# EAGLE design TouScruino-v1 (EAGLE 6.3)
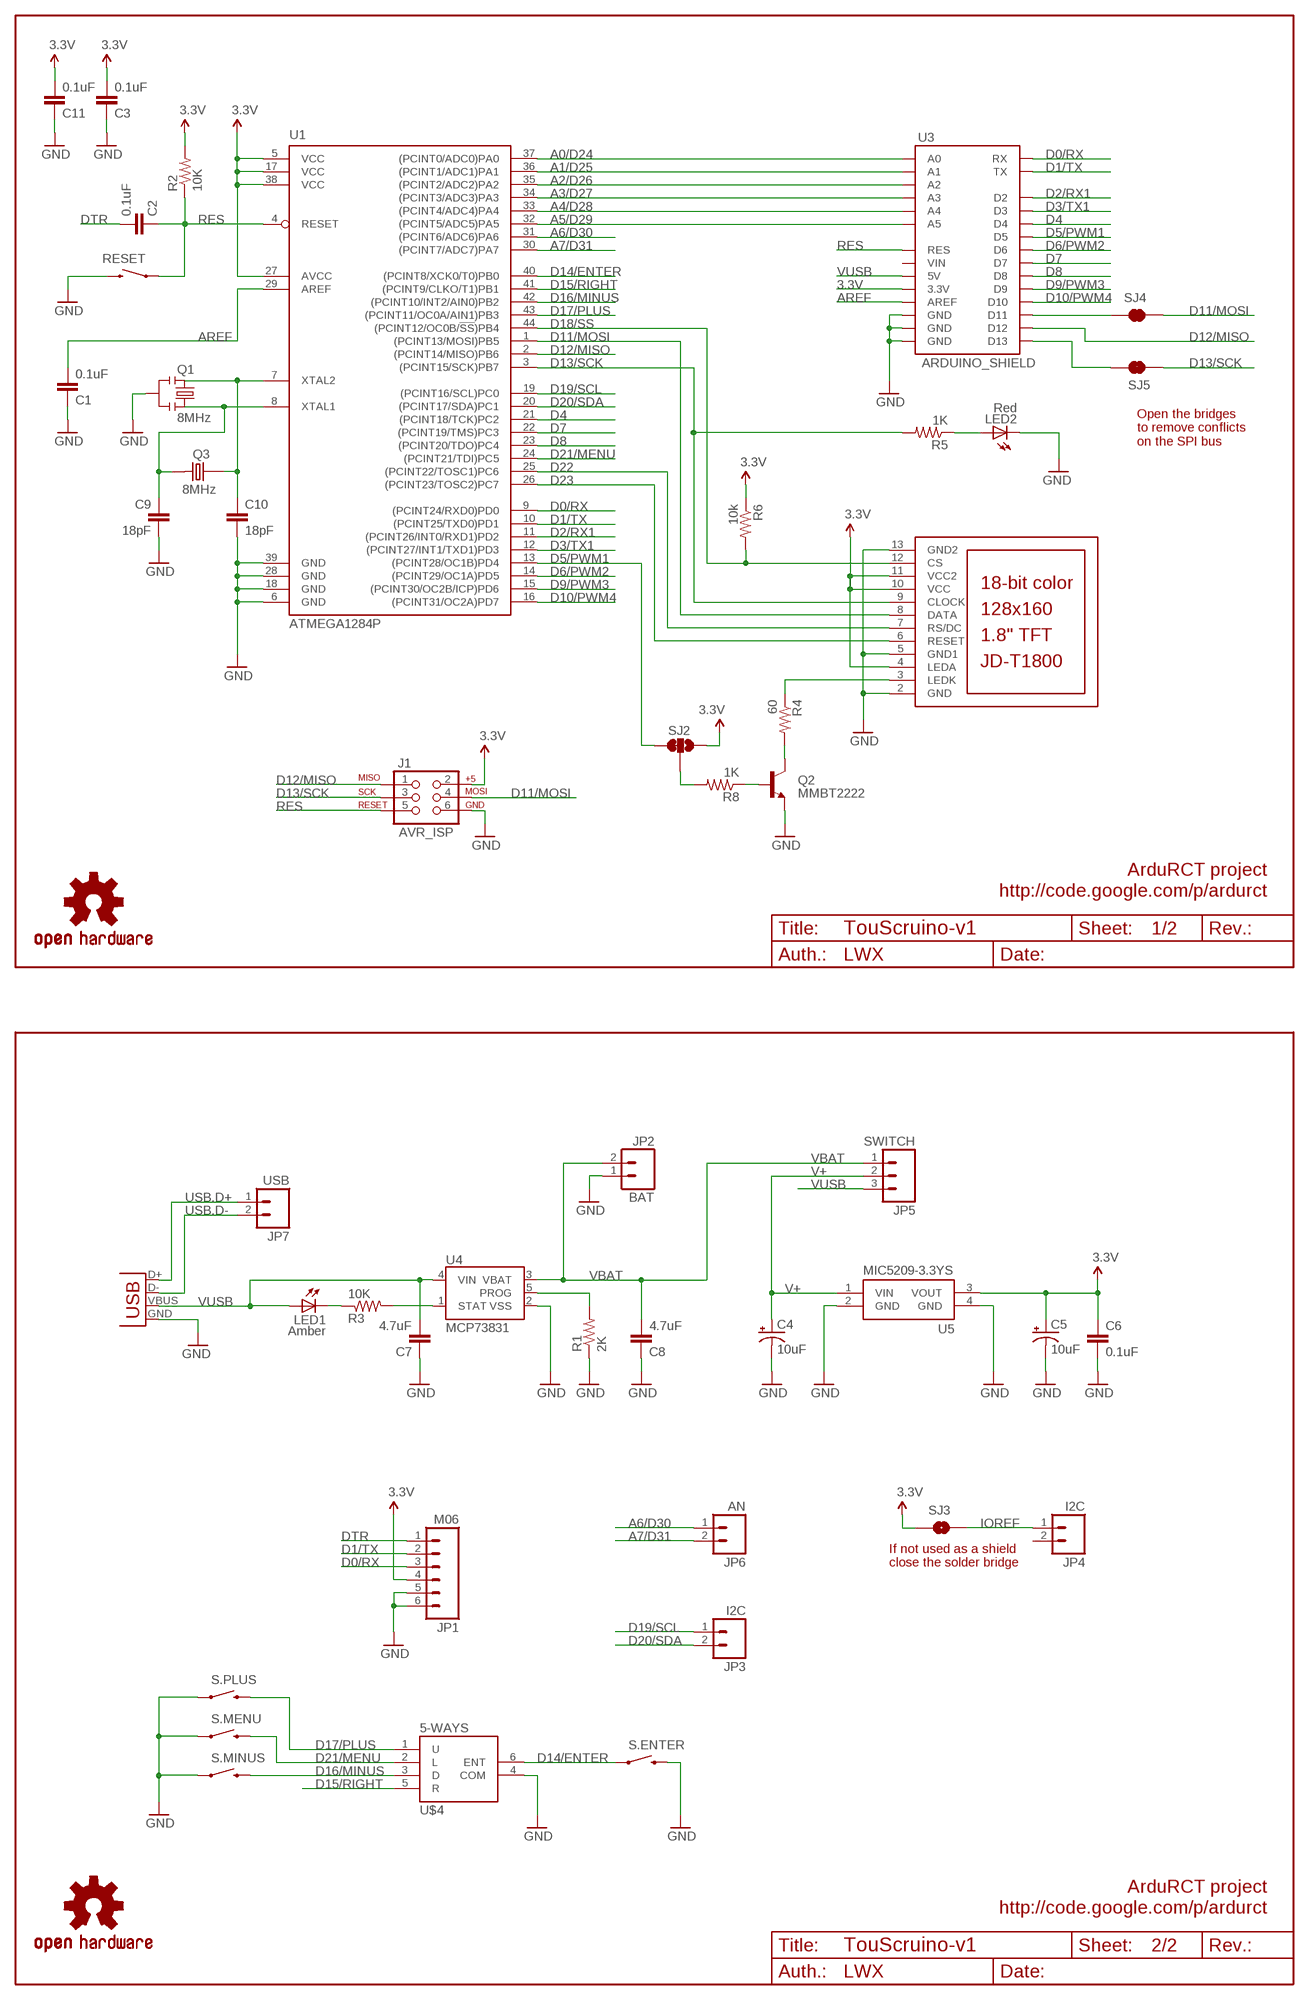
[diagram p0: schematic, sheet 1]

## Parts
C1  0.1uF  CAP0805  [0805]
C2  0.1uF  CAP0805  [0805]
C3  0.1uF  CAP0805  [0805]
C4  10uF  CAP_POL1206  [EIA3216]
C5  10uF  CAP_POL1206  [EIA3216]
C6  0.1uF  CAP0805  [0805]
C7  4.7uF  CAP0805  [0805]
C8  4.7uF  CAP0805  [0805]
C9  18pF  CAP0603-CAP  [0603-CAP]
C10  18pF  CAP0603-CAP  [0603-CAP]
C11  0.1uF  CAP0805  [0805]
J1  AVR_ISP  AVR_SPI_PRG_6PTH  [2X3]
JP1  M06  [1X06]
JP2  BAT  M02-JST-2MM-SMT  [JST-2-SMD]
JP3  I2C  M02  [1X02]
JP4  I2C  M02  [1X02]
JP5  SWITCH  M03  [1X3_LONGPAD]
JP6  AN  M02  [1X02]
JP7  USB  M02  [1X02]
LCD1  JD-T1800  [JD-T1800]
LED1  Amber  LED  [LED]
LED2  Red  LED805  [LED-0805]
Q1  8MHz  RESONATORSMD  [RESONATOR-SMD]
Q2  MMBT2222  TRANSISTOR_NPNSOT23-3  [SOT23-3]
Q3  8MHz  CRYSTAL_5X3.2  [CRYSTAL_5X3.2]
R1  2K  RESISTOR0805-RES  [0805]
R2  10K  RESISTOR0805-RES  [0805]
R3  10K  RESISTOR0805-RES  [0805]
R4  60  RESISTOR0805-RES  [0805]
R5  1K  RESISTOR0805-RES  [0805]
R6  10k  RESISTOR0805-RES  [0805]
R8  1K  RESISTOR0805-RES  [0805]
RESET  SWITCH-MOMENTARY-2SMD  [TACTILE_SWITCH_SMD]
S.ENTER  SWITCH_SMD  [TACTILE_SWITCH_SMD]
S.MENU  SWITCH_SMD  [TACTILE_SWITCH_SMD]
S.MINUS  SWITCH_SMD  [TACTILE_SWITCH_SMD]
S.PLUS  SWITCH_SMD  [TACTILE_SWITCH_SMD]
SJ2  SJ_2WAYS_1-2  [SJ_2WAYS_1-2_S]
SJ3  SOLDERJUMPERNO  [SJ_2S-NO]
SJ4  SOLDERJUMPERTRACE  [SJ_2S-TRACE]
SJ5  SOLDERJUMPERTRACE  [SJ_2S-TRACE]
U1  ATMEGA1284P  ATMEGA324A  [TQFP44]
U3  ARDUINO_SHIELD  [ARDUINO_SHIELD]
U4  MCP73831  [SOT23-5]
U5  MIC5209-3.3YS  MIC5209  [SOT223]
U$3  OSHW-LOGOM  [OSHW-LOGO-M]
U$4  5-WAYS  [5-WAYS_ALPS]
U$5  OSHW-LOGOM  [OSHW-LOGO-M]
X1  USBSMD  [USB-MINIB]

## Nets
3.3V: C3.2 C5.A(+) C6.1 C11.2 J1.2 JP1.4 LCD1.4(LEDA) LCD1.10(VCC) LCD1.11(VCC2) R2.2 R6.1 SJ2.3 SJ3.1 U1.5(VCC) U1.17(VCC) U1.27(AVCC) U1.38(VCC) U3.3.3V U5.3(VOUT)
A0/D24: U1.37((PCINT0/ADC0)PA0) U3.A0
A1/D25: U1.36((PCINT1/ADC1)PA1) U3.A1
A2/D26: U1.35((PCINT2/ADC2)PA2) U3.A2
A3/D27: U1.34((PCINT3/ADC3)PA3) U3.A3
A4/D28: U1.33((PCINT4/ADC4)PA4) U3.A4
A5/D29: U1.32((PCINT5/ADC5)PA5) U3.A5
A6/D30: JP6.1 U1.31((PCINT6/ADC6)PA6)
A7/D31: JP6.2 U1.30((PCINT7/ADC7)PA7)
AREF: C1.2 U1.29(AREF) U3.AREF
BL_CMD: R8.2 SJ2.2
D0/RX: JP1.3 U1.9((PCINT24/RXD0)PD0) U3.RX
D1/TX: JP1.2 U1.10((PCINT25/TXD0)PD1) U3.TX
D2/RX1: U1.11((PCINT26/INT0/RXD1)PD2) U3.D2
D3/TX1: U1.12((PCINT27/INT1/TXD1)PD3) U3.D3
D4: U1.21((PCINT18/TCK)PC2) U3.D4
D5/PWM1: SJ2.1 U1.13((PCINT28/OC1B)PD4) U3.D5
D6/PWM2: U1.14((PCINT29/OC1A)PD5) U3.D6
D7: U1.22((PCINT19/TMS)PC3) U3.D7
D8: U1.23((PCINT20/TDO)PC4) U3.D8
D9/PWM3: U1.15((PCINT30/OC2B/ICP)PD6) U3.D9
D10/PWM4: U1.16((PCINT31/OC2A)PD7) U3.D10
D11/MOSI: J1.4 LCD1.8(DATA) SJ4.2 U1.1((PCINT13/MOSI)PB5)
D12/MISO: J1.1 U1.2((PCINT14/MISO)PB6) U3.D12
D13/SCK: J1.3 LCD1.9(CLOCK) R5.2 SJ5.1 U1.3((PCINT15/SCK)PB7)
D14/ENTER: S.ENTER.1 U1.40((PCINT8/XCK0/T0)PB0) U$4.6(ENT)
D15/RIGHT: U1.41((PCINT9/CLKO/T1)PB1) U$4.5(R)
D16/MINUS: S.MINUS.3 U1.42((PCINT10/INT2/AIN0)PB2) U$4.3(D)
D17/PLUS: S.PLUS.3 U1.43((PCINT11/OC0A/AIN1)PB3) U$4.1(U)
D18/SS: LCD1.12(CS) R6.2 U1.44((PCINT12/OC0B/!SS!)PB4)
D19/SCL: JP3.1 U1.19((PCINT16/SCL)PC0)
D20/SDA: JP3.2 U1.20((PCINT17/SDA)PC1)
D21/MENU: S.MENU.3 U1.24((PCINT21/TDI)PC5) U$4.2(L)
D22: LCD1.7(RS/DC) U1.25((PCINT22/TOSC1)PC6)
D23: LCD1.6(RESET) U1.26((PCINT23/TOSC2)PC7)
DTR: C2.2 JP1.1
GND [vcc]: C1.1 C3.1 C4.C(-) C5.C(-) C6.2 C7.1 C8.1 C9.2 C10.2 C11.1 J1.6 JP1.5 JP1.6 JP2.1 LCD1.2(GND) LCD1.5(GND1) LCD1.13(GND2) LED2.2(C) Q1.2 Q2.2(E) R1.1 RESET.3 S.ENTER.3 S.MENU.1 S.MINUS.1 S.PLUS.1 U1.6(GND) U1.18(GND) U1.28(GND) U1.39(GND) U3.GND@0(GND) U3.GND@1(GND) U3.GND@2(GND) U4.2(VSS) U5.2(GND) U5.4(GND) U$4.4(COM) X1.GND
IOREF: JP4.1 SJ3.2
N$1: C9.1 Q1.1 Q3.2 U1.8(XTAL1)
N$2: C10.1 Q1.3 Q3.1 U1.7(XTAL2)
N$3: LCD1.3(LEDK) R4.1
N$4: Q2.1(B) R8.1
N$5: LED2.1(A) R5.1
N$6: SJ4.1 U3.D11
N$8: LED1.C1(C) R3.1
N$9: SJ5.2 U3.D13
N$12: R3.2 U4.1(STAT)
N$13: R1.2 U4.5(PROG)
N$17: Q2.3(C) R4.2
RES: C2.1 J1.5 R2.1 RESET.1 U1.4(RESET) U3.RES
USB.D+: JP7.1 X1.D+
USB.D-: JP7.2 X1.D-
V+: C4.A(+) JP5.2 U5.1(VIN)
VBAT: C8.2 JP2.2 JP5.1 U4.3(VBAT)
VUSB: C7.2 JP5.3 LED1.A1(A) U3.5V U4.4(VIN) X1.VBUS
Unconnected: JP4.2 U3.VIN

## Notes on the sheet
- Open the bridges
  to remove conflicts
  on the SPI bus
- ArduRCT project
- http://code.google.com/p/ardurct
- 1/2
- LWX
- If not used as a shield
  close the solder bridge
- ArduRCT project
- http://code.google.com/p/ardurct
- 2/2
- LWX

## Library data of the parts
C1-C3 C6-C11 = SparkFun:CAP: Capacitor Standard 0603 ceramic capacitor, and 0.1" leaded capacitor.
C4 C5 = SparkFun:CAP_POL: Capacitor Polarized These are standard SMD and PTH capacitors. Normally 10uF, 47uF, and 100uF in electrolytic and tantalum varieties. Always verify the external diameter of the through hole cap, it varies with capacity, voltage, and manufacturer. The EIA devices should be standard.
J1 = SparkFun:AVR_SPI_PRG_6: AVR ISP 6 Pin This is the reduced ISP connector for AVR programming. Common on Arduino. This footprint will take up less PCB space and can be used with a 10-pin to 6-pin adapter such as SKU: BOB-08508
JP1 = wibauxl:M06
JP2 = SparkFun:M02: Header 2 Standard 2-pin 0.1" header. Use with straight break away headers (SKU : PRT-00116), right angle break away headers (PRT-00553), swiss pins (PRT-00743), machine pins (PRT-00117), and female headers (PRT-00115). Molex polarized connector foot print use with SKU : PRT-08233 with associated crimp pins and housings.
JP3 JP4 JP6 JP7 = wibauxl:M02
JP5 = wibauxl:M03
LCD1 = adafruit:JD-T1800
LED1 LED2 = wibauxl:LED
Q1 = SparkFun:RESONATOR: Resonator Small SMD resonator. This is the itty bitty 10/20MHz resonators with built in caps. CSTCE10M0G55 and CSTCE20M0V53. Footprint has been reviewed closely but hasn't been tested yet.
Q2 = SparkFun:TRANSISTOR_NPN: Transistor NPN BJT configuration in SOT23 package. MMBT2222 is the common NPN we use. Double check BCE configuration again layout.
Q3 = wibauxl:CRYSTAL_5X3.2
R1-R6 R8 = SparkFun:RESISTOR: Resistor Basic schematic elements and footprints for 0603, 1206, and PTH resistors.
RESET = SparkFun:SWITCH-MOMENTARY-2
S.ENTER S.MENU S.MINUS S.PLUS = wibauxl:SWITCH_SMD
SJ2 = wibauxl:SJ_2WAYS_1-2
SJ3-SJ5 = SparkFun:SOLDERJUMPER: Solder Jumper Standard SMD solder jumper. Used to automate production. Two varients : Normally Open and Normally Closed are the same, but have different paste layers. NC will have a large amount of paste and should jumper during reflow.
U1 = wibauxl:ATMEGA324: 8-bit Microcontroller with 64K Bytes In-System Programmable Flash Source: http://www.atmel.com/dyn/resources/prod_documents/doc2593.pdf
U3 = wibauxl:ARDUINO_SHIELD
U4 = SparkFun:MCP73831: Microchip's MCP73831 Miniature single cell, fully integrated Li-Ion, Li-polymer charge management controller http://ww1.microchip.com/downloads/en/DeviceDoc/21984a.pdf
U5 = wibauxl:MIC5209
U$3 U$5 = SparkFun:OSHW-LOGO: Open Source Hardware Logo This logo indicates the piece of hardware it is found on incorporates a OSHW license and/or adheres to the definition of open source hardware found here: http://freedomdefined.org/OSHW
U$4 = wibauxl:5-WAYS
X1 = SparkFun:USB: USB Connectors USB-B-PTH is fully proven SKU : PRT-00139 USB-miniB is fully proven SKU : PRT-00587 USB-A-PCB is untested. USB-A-H is throughly reviewed, but untested. Spark Fun Electronics SKU : PRT-00437 USB-B-SMT is throughly reviewed, but untested. Needs silkscreen touching up. USB-A-S has not been used/tested USB-MB-H has not been used/tested

## Net classes
0 default: width 0.203 mm
1 vcc: width 0.254 mm

## Board
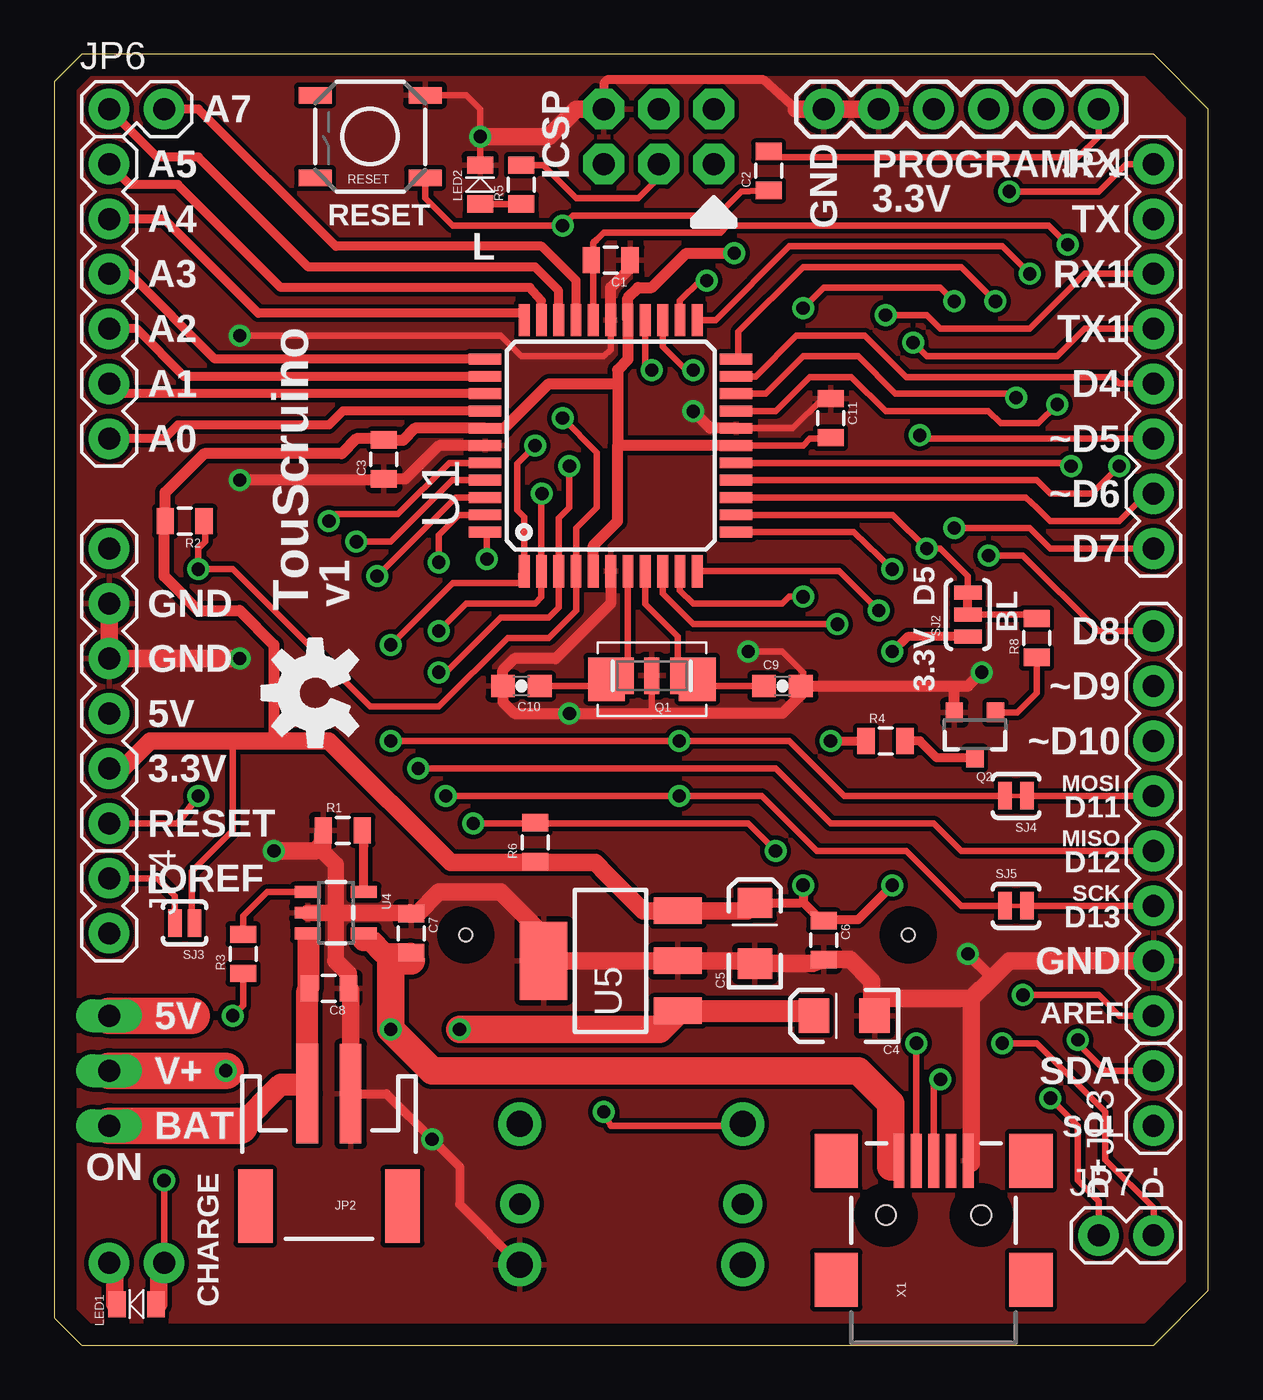
[diagram p1: board, top side]
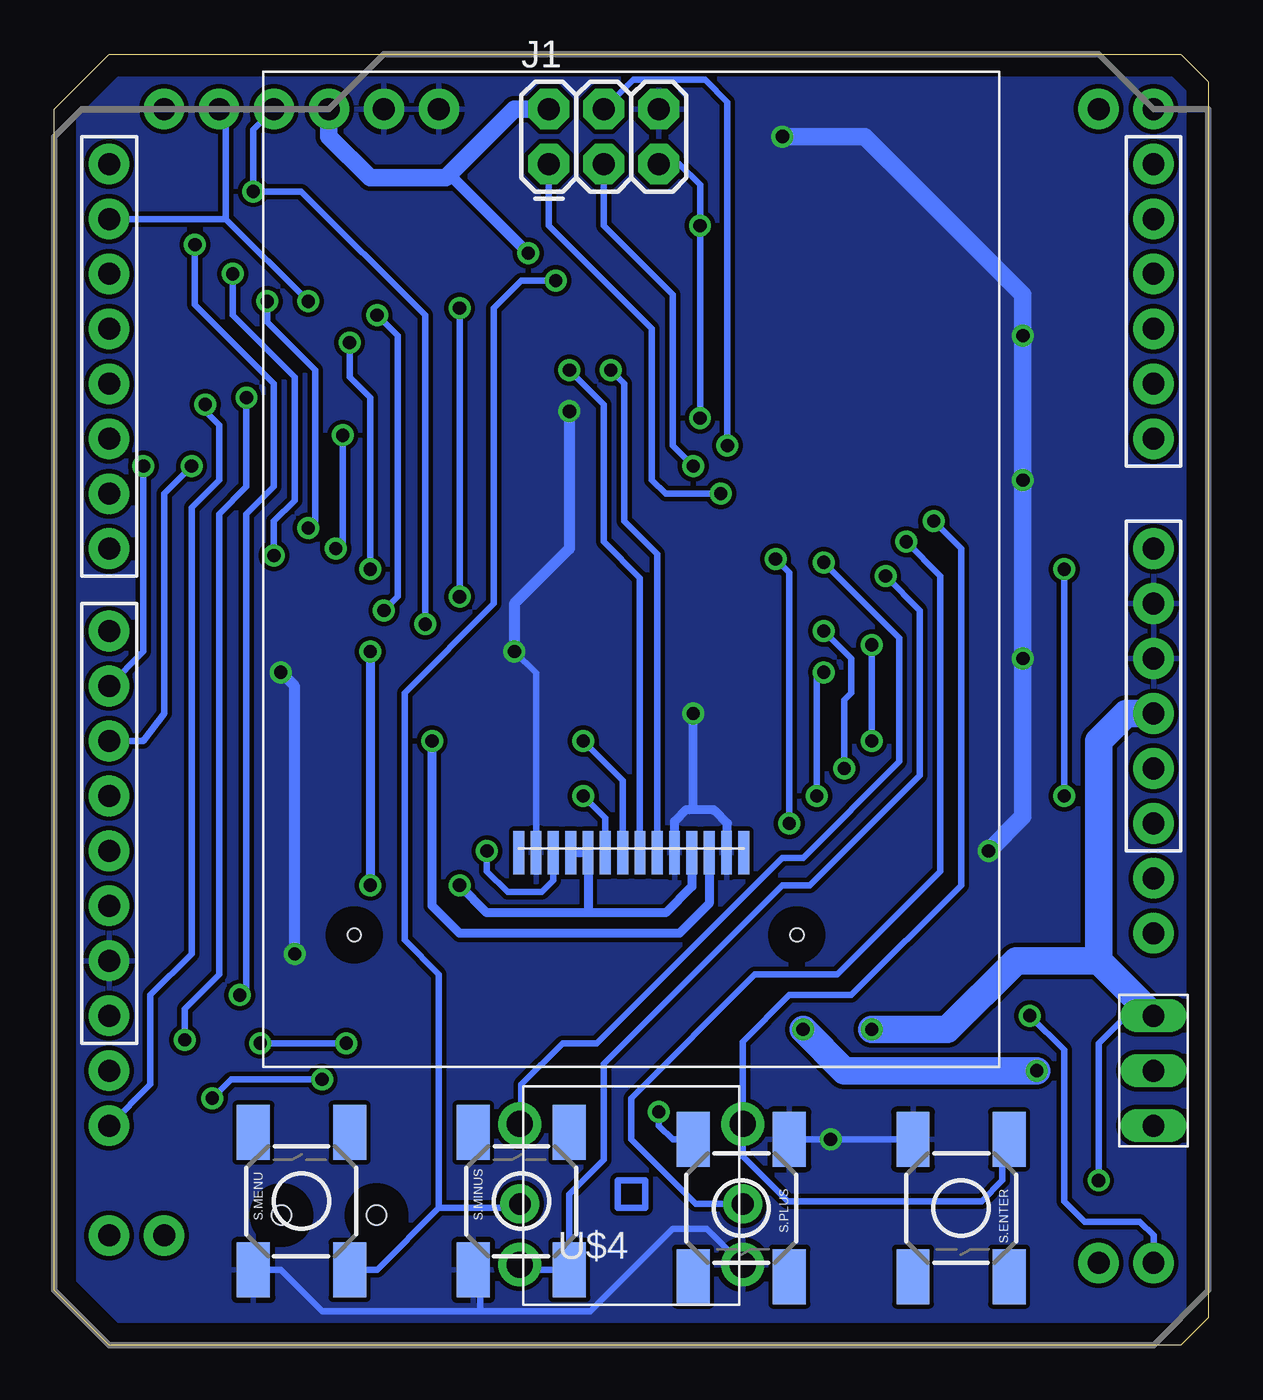
[diagram p2: board, bottom side, seen from below]

Size 53.34 x 59.69 mm. Coordinates in mm from the lower left corner, seen from the top.
Outline: 53.34,2.54 53.34,57.15 50.8,59.69 1.27,59.69 0,58.42 0,1.27 1.27,0 50.8,0 53.34,2.54
Copper layers (1*16): Top 0.035mm / dielectric 1.5mm / Bottom 0.035mm
Design rules "default": minimum track width 10mil, minimum drill 24mil, track to track 8mil, track to pad 8mil, pad to pad 8mil, via to via 8mil, smd to smd 8mil, copper to edge 40mil, drill to drill 8mil, minimum pad ring 10mil, minimum via ring 8mil, stop-mask expansion 4mil, vias tented up to drill 0mil, thermal gap 10mil

### Footprints (pad centres in the part's own frame; a part is rotated, then mirrored left to right if it is on the bottom)
0805 = smd 0.8 x 1.2: 1 -0.9,0; 2 0.9,0
EIA3216 = smd 1.4 x 1.6: A 1.4,0; C -1.4,0
0603-CAP = smd 1.1 x 1: 1 -0.85,0; 2 0.85,0
2X3 = drill 1.016 pad 1.88 octagon: 1 0,0; 2 0,2.54; 3 2.54,0; 4 2.54,2.54; 5 5.08,0; 6 5.08,2.54
1X06 = drill 1.016 pad 1.88: 1 0,0; 2 2.54,0; 3 5.08,0; 4 7.62,0; 5 10.16,0; 6 12.7,0
JST-2-SMD = smd 1 x 4.6: 1 -1,-3.7; 2 1,-3.7 | smd 1.6 x 3.4: NC1 -3.4,1.5; NC2 3.4,1.5
1X02 = drill 1.016 pad 1.88: 1 0,0; 2 2.54,0
1X3_LONGPAD = drill 1.016 pad 1.245 long: 1 0,0; 2 -2.54,0; 3 -5.08,0
JD-T1800 = smd 0.5 x 2: 1 5.2,-13.1; 2 4.4,-13.1; 3 3.6,-13.1; 4 2.8,-13.1; 5 2,-13.1; 6 1.2,-13.1; 7 0.4,-13.1; 8 -0.4,-13.1; 9 -1.2,-13.1; 10 -2,-13.1; 11 -2.8,-13.1; 12 -3.6,-13.1; 13 -4.4,-13.1; 14 -5.2,-13.1 | hole 0.61: -12.8,-16.9; 7.65,-16.9
LED = smd 0.8 x 1.2: A -0.9,0; C 0.9,0 | drill 1.016 pad 1.88: A1 -1.27,-1.905; C1 1.27,-1.905
LED-0805 = smd 0.8 x 1.2: 1 -0.9,0; 2 0.9,0
RESONATOR-SMD = smd 0.7 x 1.7: 1 -1.2,0; 2 0,0; 3 1.2,0
SOT23-3 = smd 0.8 x 0.9: 1 -0.95,-1; 2 0.95,-1; 3 0,1.1
CRYSTAL_5X3.2 = smd 1.7 x 2: 1 2.1,0; 2 -2.1,0
TACTILE_SWITCH_SMD = smd 1.524 x 0.762: 1 -2.54,1.905; 2 2.54,1.905; 3 -2.54,-1.905; 4 2.54,-1.905
TACTILE_SWITCH_SMD' = smd 2.54 x 1.524: 1 -3.175,2.223; 2 3.175,2.223; 3 -3.175,-2.223; 4 3.175,-2.223
SJ_2WAYS_1-2_S = smd 0.635 x 1.27: 1 0.508,0; 2 -0.508,0; 3 -1.524,0
SJ_2S-NO = smd 0.635 x 1.27: 1 -0.45,0; 2 0.45,0
SJ_2S-TRACE = smd 0.635 x 1.27: 1 -0.508,0; 2 0.508,0
TQFP44 = smd 1.5 x 0.5: 1 -5.8,4; 2 -5.8,3.2; 3 -5.8,2.4; 4 -5.8,1.6; 5 -5.8,0.8; 6 -5.8,0; 7 -5.8,-0.8; 8 -5.8,-1.6; 9 -5.8,-2.4; 10 -5.8,-3.2; 11 -5.8,-4; 23 5.8,-4; 24 5.8,-3.2; 25 5.8,-2.4; 26 5.8,-1.6; 27 5.8,-0.8; 28 5.8,0; 29 5.8,0.8; 30 5.8,1.6; 31 5.8,2.4; 32 5.8,3.2; 33 5.8,4 | smd 0.5 x 1.5: 12 -4,-5.8; 13 -3.2,-5.8; 14 -2.4,-5.8; 15 -1.6,-5.8; 16 -0.8,-5.8; 17 0,-5.8; 18 0.8,-5.8; 19 1.6,-5.8; 20 2.4,-5.8; 21 3.2,-5.8; 22 4,-5.8; 34 4,5.8; 35 3.2,5.8; 36 2.4,5.8; 37 1.6,5.8; 38 0.8,5.8; 39 0,5.8; 40 -0.8,5.8; 41 -1.6,5.8; 42 -2.4,5.8; 43 -3.2,5.8; 44 -4,5.8
ARDUINO_SHIELD = drill 1.016 pad 1.88: 3.3V 33.02,50.8; 5V 30.48,50.8; A0 17.78,50.8; A1 15.24,50.8; A2 12.7,50.8; A3 10.16,50.8; A4 7.62,50.8; A5 5.08,50.8; AREF 44.45,2.54; D2 10.16,2.54; D3 12.7,2.54; D4 15.24,2.54; D5 17.78,2.54; D6 20.32,2.54; D7 22.86,2.54; D8 26.67,2.54; D9 29.21,2.54; D10 31.75,2.54; D11 34.29,2.54; D12 36.83,2.54; D13 39.37,2.54; GND@0 27.94,50.8; GND@1 25.4,50.8; GND@2 41.91,2.54; RES 35.56,50.8; RX 5.08,2.54; TX 7.62,2.54; VIN 22.86,50.8
SOT23-5 = smd 0.55 x 1.2: 1 -0.95,-1.3; 2 0,-1.3; 3 0.95,-1.3; 4 0.95,1.3; 5 -0.95,1.3
SOT223 = smd 1.219 x 2.235: 1 -2.311,-3.099; 2 0,-3.099; 3 2.311,-3.099 | smd 3.6 x 2.2: 4 0,3.099
5-WAYS_ALPS = drill 1.2 pad 2: 1 -5.15,3.25; 3 -5.15,-3.25; 4 5.15,-3.25; 6 5.15,3.25 | drill 1 pad 1.8: 2 -5.15,-0.45; 5 5.15,-0.45
USB-MINIB = smd 2.5 x 0.5: D+ 2.5,0; D- 2.5,0.8; GND 2.5,-1.6; ID 2.5,-0.8; VBUS 2.5,1.6 | smd 2.5 x 2: MTN1 -3,4.5; MTN2 2.5,4.5; MTN3 -3,-4.5; MTN4 2.5,-4.5 | hole 0.9: 0,2.2; 0,-2.2

### Placement (x,y rotation side)
C1  25.72,50.16 180 top
C2  33.02,54.29 90 top
C3  15.24,40.96 90 top
C4  36.51,15.24 180 top
C5  32.38,19.05 90 top
C6  35.56,18.73 270 top
C7  16.51,19.05 270 top
C8  12.7,16.51 180 top
C9  33.66,30.48 0 top
C10  21.59,30.48 180 top
C11  35.88,42.86 270 top
J1  30.48,54.61 0 bottom
JP1  48.26,57.15 180 top
JP2  12.7,7.94 180 top
JP3  50.8,10.16 90 top
JP4  2.54,21.59 270 top
JP5  2.54,10.16 270 bottom
JP6  2.54,57.15 0 top
JP7  48.26,5.08 0 top
LCD1  26.67,35.88 0 bottom
LED1  3.81,1.91 180 top
LED2  19.68,53.66 90 top
Q1  27.62,30.96 180 top
Q2  42.55,28.26 180 top
Q3  27.62,30.8 180 top
R1  13.34,23.81 0 top
R2  6.03,38.1 180 top
R3  8.73,18.1 90 top
R4  38.42,27.94 0 top
R5  21.59,53.66 90 top
R6  22.23,23.26 90 top
R8  45.4,32.7 90 top
RESET  14.61,55.88 180 top
S.ENTER  [TACTILE_SWITCH_SMD']  11.43,6.35 270 bottom
S.MENU  [TACTILE_SWITCH_SMD']  41.91,6.67 90 bottom
S.MINUS  [TACTILE_SWITCH_SMD']  31.75,6.67 90 bottom
S.PLUS  [TACTILE_SWITCH_SMD']  21.59,6.35 270 bottom
SJ2  42.23,34.29 90 top
SJ3  6.03,19.53 180 top
SJ4  44.45,25.4 180 top
SJ5  44.45,20.32 0 top
U1  25.72,41.59 90 top
U3  53.34,59.69 270 bottom
U4  13.02,20 270 top
U5  25.72,17.78 90 top
U$3  12.06,30.16 90 top
U$4  26.67,6.99 0 bottom
U$5  12.06,30.16 90 top
X1  40.64,6.03 90 top

### Tracks (layer width: path | path; a pad name or v marks a point on that pad's centre or on a via)
3.3V  (via drill 0.61)
  Top 0.305: SJ3.1 6.48,19.82 6.35,19.68 6.35,21.91 8.26,23.81 8.26,27.94 12.7,27.94 | U1.17 34.61,41.59 34.92,41.91 35.83,41.91 C11.2 | 25.56,21.75 25.72,21.59 | R6.1 22.23,22.31
  Top 0.406: SJ2.3 39.43,32.77 v38.73,32.07 | v38.73,21.27 37.15,19.68 35.4,19.68 35.24,19.84 | 35.83,19.68 C6.1 35.35,19.84 35.24,19.84 | 35.24,19.84 34.61,20.48 | C5.A 34.42,20.45 34.61,20.48 | v34.61,21.27 34.61,20.48
  Top 0.508: 26.04,44.45 22.86,44.45 20.8,42.39 U1.38 16.68,42.39 16.11,41.83 15.32,41.83 15.24,41.91 C3.2 14.92,41.91 13.97,41.91 13.28,41.22 6.93,41.22 5.13,39.42 R2.2 5.08,38.37 5.08,35.56 6.67,33.97 8.57,33.97 10.16,32.38 10.16,27.94 | 26.04,44.45 26.04,45.09 26.52,45.57 U1.27 26.52,48.42 26.99,48.9 27.62,48.9 29.21,50.48 v31.43,50.48 | 26.04,44.45 26.04,41.59 | U1.17 26.04,41.59 | U1.5 24.92,36.98 26.04,38.1 26.04,41.59 | 35.51,19.68 C6.1
  Top 0.813: C5.A 32.03,20.09 U5.3 27.22,20.09 25.56,21.75 24.99,22.31 22.23,22.31 18.33,22.31 12.7,27.94 10.16,27.94 8.26,27.94 4.45,27.94 3.17,26.67 U3.3.3V
  Bottom 0.406: v38.73,32.07 v38.73,21.27 | LCD1.4 23.87,21.21 25.08,20 28.57,20 | 28.57,20 33.34,20 v34.61,21.27 | LCD1.11 LCD1.10 28.67,20.1 28.57,20
  Bottom 0.508: v31.43,50.48 35.08,54.13
  Bottom 0.813: JP1.4 40.64,55.88 38.73,53.98 35.24,53.98 35.08,54.13 32.07,57.15 J1.2
A0/D24
  Top 0.406: U1.37 13.35,43.19 12.7,42.55 5.71,42.55 | 5.71,42.55 5.73,42.56 | 5.71,42.55 5.08,41.91 U3.A0
A1/D25
  Top 0.406: U1.36 3,43.99 U3.A1
A2/D26
  Top 0.406: U1.35 6.01,44.79 3.81,46.99 U3.A2
A3/D27
  Top 0.406: U1.34 7.43,45.59 3.49,49.53 U3.A3
A4/D28
  Top 0.406: U3.A4 5.08,52.07 9.44,47.71 21.72,47.71 U1.33
A5/D29
  Top 0.406: U1.32 22.52,48.28 21.99,48.9 10.48,48.9 5.71,53.66 3.49,53.66 U3.A5
A6/D30
  Top 0.406: U1.31 23.32,48.76 22.23,49.85 11.75,49.85 6.67,54.93 4.76,54.93 JP6.1
A7/D31
  Top 0.406: U1.30 24.12,49.23 22.54,50.8 13.02,50.8 6.67,57.15 JP6.2
AREF  (via drill 0.61)
  Top 0.305: 24.92,50.27 C1.2 | U1.29 24.92,50.27 | 24.92,50.27 24.92,50.97 25.08,51.12 25.4,51.44 30.8,51.44 31.11,51.75 45.96,51.75 v46.83,50.88 | U3.AREF 49.21,15.24 48.26,16.19 v44.77,16.19
  Bottom 0.305: v46.83,50.88 46.83,48.1 43.18,44.45 43.18,39.69 44.45,38.42 44.45,16.51 v44.77,16.19
BL_CMD
  Top 0.305: SJ2.2 45.22,33.78 R8.2
D0/RX  (via drill 0.61)
  Top 0.305: U1.9 28.12,34.75 29.53,33.34 v36.2,33.34 | v44.13,53.34 48.26,53.34 49.53,54.61 U3.RX
  Bottom 0.305: v36.2,33.34 36.2,47.62 41.91,53.34 v44.13,53.34 44.13,56.2 JP1.3
D1/TX  (via drill 0.61)
  Top 0.305: U1.10 28.92,34.9 29.53,34.29 33.66,34.29 33.97,34.61 v34.61,34.61 | v34.61,47.94 35.56,48.9 40.96,48.9 v41.59,48.26
  Bottom 0.305: v34.61,34.61 v34.61,47.94 | v41.59,48.26 45.4,52.07 | 45.4,52.07 U3.TX | 45.4,52.07 45.4,56.83 JP1.2
D2/RX1  (via drill 0.61)
  Top 0.305: U1.11 36.27,35.79 v38.1,33.97 | v38.42,47.62 40.32,47.62 40.96,46.99 45.09,46.99 47.62,49.53 U3.D2
  Bottom 0.305: v38.1,33.97 37.47,34.61 37.47,46.67 v38.42,47.62
D3/TX1  (via drill 0.61)
  Top 0.305: U1.12 36.96,37.59 v38.73,35.88 | v39.69,46.35 40.32,45.72 46.35,45.72 47.62,46.99 U3.D3
  Bottom 0.305: v38.73,35.88 38.73,43.81 39.69,44.77 v39.69,46.35
D4
  Top 0.305: U1.21 32.41,44.79 34.29,46.67 37.47,46.67 39.37,44.77 48.9,44.77 49.21,44.45 U3.D4
D5/PWM1  (via drill 0.61)
  Top 0.305: U1.13 38.76,38.39 v40.32,36.83 40.96,36.83 42.23,35.56 SJ2.1 | U3.D5 40.01,41.91 v40.01,42.07
  Bottom 0.305: v40.01,42.07 40.01,36.83 v40.32,36.83
D6/PWM2
  Top 0.305: U1.14 44.91,39.19 45.4,38.73 46.04,38.1 49.21,38.1 50.16,39.05 50.48,39.05 U3.D6
D7  (via drill 0.61)
  Top 0.305: U1.22 31.62,45.59 31.62,46.86 34.61,49.85 41.91,49.85 v43.5,48.26 | v41.59,37.78 45.09,37.78 46.04,36.83 U3.D7
  Bottom 0.305: v43.5,48.26 43.5,47.31 41.27,45.09 41.27,38.1 v41.59,37.78
D8  (via drill 0.61)
  Top 0.305: U1.23 30.57,47.39 33.97,50.8 43.81,50.8 v45.09,49.53 | v43.18,36.51 44.77,36.51 48.26,33.02 U3.D8
  Bottom 0.305: v45.09,49.53 45.09,47.62 42.23,44.77 42.23,39.05 43.18,38.1 v43.18,36.51
D9/PWM3  (via drill 0.61)
  Top 0.305: U1.15 35.87,39.99 36.51,40.01 45.4,40.01 46.04,39.37 47.94,39.37 v49.21,40.64
  Bottom 0.305: v49.21,40.64 49.21,32.07 U3.D9
D10/PWM4  (via drill 0.61)
  Top 0.305: U1.16 46.84,40.79 v46.99,40.64
  Bottom 0.305: v46.99,40.64 48.26,39.37 48.26,29.21 49.21,27.94 U3.D10
D11/MOSI  (via drill 0.61)
  Top 0.305: v22.23,41.59 21.4,40.77 21.4,38.61 21.72,38.29 U1.1 21.59,35.66 21.59,35.24 18.41,35.24 v15.56,32.38 | v15.56,27.94 v28.89,27.94 33.97,27.94 36.51,25.4 SJ4.2
  Bottom 0.305: J1.4 26.59,58.5 23.26,58.5 22.23,57.47 v22.23,41.59 | LCD1.8 27.07,26.12 v28.89,27.94 | v15.56,27.94 v15.56,32.38
D12/MISO  (via drill 0.61)
  Top 0.305: v17.78,33.02 19.05,34.29 22.23,34.29 22.52,34.58 U1.2 22.52,39.03 v22.54,39.37 | v16.83,26.67 33.34,26.67 35.88,24.13 40.64,24.13 41.91,22.86 U3.D12
  Bottom 0.305: v17.78,33.02 16.51,31.75 16.51,30.16 16.83,29.84 v16.83,26.67 | v22.54,39.37 25.08,39.37 25.72,40.01 25.72,46.99 30.48,51.75 J1.1
D13/SCK  (via drill 0.61)
  Top 0.305: J1.3 27.94,53.98 26.99,53.02 24.13,53.02 22.59,54.56 R5.2 | v17.78,31.11 18.1,31.11 20.64,33.66 22.86,33.66 23.32,34.11 U1.3 23.32,38.24 23.81,38.73 v23.81,40.64 | v18.1,25.4 v28.89,25.4 32.7,25.4 35.24,22.86 39.37,22.86 41.91,20.32 SJ5.1
  Bottom 0.305: v23.81,40.64 24.77,41.59 24.77,48.58 27.94,51.75 J1.3 | LCD1.9 27.87,24.38 v28.89,25.4 | v18.1,25.4 18.1,30.8 v17.78,31.11
D14/ENTER  (via drill 0.61)
  Top 0.305: U1.40 18.25,40.79 15.88,38.42 13.02,38.42 v12.7,38.1
  Bottom 0.305: v12.7,38.1 11.43,36.83 11.43,21.27 16.51,16.19 19.37,16.19 21.52,14.04 U$4.6 21.52,8.74 19.45,6.67 10.48,6.67 9.53,7.62 9.53,9.21 S.ENTER.1
D15/RIGHT  (via drill 0.61)
  Top 0.305: U1.41 18.4,39.99 15.56,37.15 v13.97,37.15
  Bottom 0.305: v13.97,37.15 12.38,35.56 12.38,21.91 17.14,17.14 20.95,17.14 26.67,11.43 26.67,9.53 23.68,6.54 U$4.5
D16/MINUS  (via drill 0.61)
  Top 0.305: U1.42 18.55,39.19 v14.92,35.56
  Bottom 0.305: v14.92,35.56 13.34,33.97 13.34,26.35 18.41,21.27 19.68,21.27 27.94,13.02 27.94,8.57 29.53,6.99 29.53,4.45 29.84,4.13 S.MINUS.3 31.58,3.49 U$4.3
D17/PLUS  (via drill 0.61)
  Top 0.305: U1.43 18.71,38.39 17.78,37.47 v17.78,36.2 | v25.4,10.79 25.72,10.16 31.75,10.16 U$4.1
  Bottom 0.305: v17.78,36.2 14.29,32.7 14.29,26.99 18.73,22.54 19.68,22.54 28.26,13.97 29.84,13.97 31.75,12.06 31.75,10.3 U$4.1 | S.PLUS.3 24.77,9.53 25.4,10.16 v25.4,10.79
D18/SS  (via drill 0.61)
  Top 0.305: U1.44 20,37.47 v20,36.35 | v33.34,22.86 32.07,24.13 22.25,24.13 R6.2 22.2,24.13 v19.37,24.13
  Bottom 0.305: LCD1.12 30.27,21.48 30.8,20.95 32.38,20.95 33.34,21.91 v33.34,22.86 | v19.37,24.13 19.37,35.72 v20,36.35
D19/SCL  (via drill 0.61)
  Top 0.305: U1.19 33.35,43.19 34.92,44.77 36.83,44.77 38.42,43.18 43.17,43.19 43.74,42.62 45.48,42.62 v46.35,43.5
  Bottom 0.305: v46.35,43.5 46.35,43.18 45.72,42.55 45.72,40.01 46.99,38.73 46.99,18.1 48.9,16.19 48.9,12.06 JP3.1
D20/SDA  (via drill 0.61)
  Top 0.305: v44.45,43.81 44.27,43.99 38.88,43.99 37.15,45.72 34.61,45.72 32.88,43.99 U1.20 | v47.31,14.13 47.31,13.97 48.58,12.7 JP3.2
  Bottom 0.305: v44.45,43.81 44.45,39.69 45.72,38.42 45.72,17.14 47.31,15.56 v47.31,14.13
D21/MENU  (via drill 0.61)
  Top 0.305: U1.24 28.92,48.28 29.84,49.21 v30.16,49.21
  Bottom 0.305: v30.16,49.21 31.75,49.21 33.02,47.94 33.02,34.29 37.15,30.16 37.15,18.73 35.56,17.14 35.56,6.35 | S.MENU.3 38.42,3.49 35.56,6.35 | 35.56,6.35 32.01,6.35 U$4.2
D22  (via drill 0.61)
  Top 0.305: U1.25 28.12,46.18 29.21,45.09 v29.53,45.09
  Bottom 0.305: LCD1.7 26.27,35.48 27.94,37.15 27.94,43.5 v29.53,45.09
D23  (via drill 0.61)
  Top 0.305: U1.26 27.32,45.39 v27.62,45.09
  Bottom 0.305: LCD1.6 25.47,36.58 26.99,38.1 26.99,44.45 v27.62,45.09
DTR
  Top 0.305: JP1.1 48.26,55.88 47.31,54.93 33.34,54.93 C2.2
GND  (via drill 0.61)
  Top 0.305: 27.62,29.21 Q1.2 | 34.61,30.48 C9.2 34.51,30.06 34.61,30.16 34.61,30.48 | 26.67,50.53 C1.1 26.62,50.53 26.67,49.85 | v23.81,29.21 21.27,29.21 20.64,29.84 C10.2 | 34.61,30.48 34.61,31.11 33.66,32.07 v32.07,32.07 | U1.18 34.14,42.39 35.51,43.76 C11.1 | 25.72,48.9 25.72,46.04 25.4,45.72 21.59,45.72 20.64,46.67 v8.57,46.67 | LED2.2 v19.68,55.88 19.68,57.15 19.05,57.78 RESET.3
  Top 0.406: JP2.1 15.35,11.64 v17.46,9.53 18.73,8.26 18.73,6.52 U$4.4 | X1.GND 42.51,8.53 42.39,8.41 | 34.29,57.15 32.78,58.5 25.56,58.5 25.4,58.34 25.4,57.47
  Top 0.508: 34.51,30.06 33.66,29.21 27.62,29.21 21.27,29.21 20.74,29.74 C10.2 20.74,31.22 21.27,31.75 23.18,31.75 25.72,34.29 U1.6 | 34.61,30.48 41.59,30.48 | 41.59,30.48 42.23,30.48 v42.86,31.11 | 16.25,40.06 17.78,41.59 U1.39 | C3.1 16.25,40.06 | 16.25,40.06 14.92,40.01 v8.57,40.01 | U1.28 25.72,48.9 26.67,49.85 26.67,50.53 | U1.18 30.32,42.39 v29.53,43.18 | 43.34,16.99 v42.23,18.1 | Q2.2 41.59,30.48
  Top 0.762: U4.2 13.02,20 | 13.02,20 16.46,20 | C8.1 13.6,17.2 | 13.02,17.78 13.02,20 | R1.1 12.44,22.81 13.02,22.23 13.02,20
  Top 0.813: JP2.1 13.7,16.41 C8.1 | 16.46,20 C7.1 16.77,19.95 17.78,20.95 20.64,20.95 21.91,19.68 23.12,18.36 22.23,18.73 U5.4 U5.2 32.57,17.78 C5.C 35.06,17.65 C6.2 36.78,17.83 37.78,16.83 37.78,16.03 | 13.6,17.2 13.02,17.78 | 42.39,8.41 42.39,16.03 | U3.GND@2 44.13,17.78 43.34,16.99 42.39,16.03 | U3.GND@1 U3.GND@0 v8.57,31.75 | v10.16,22.86 12.06,22.86 12.38,23.18 12.38,23.23 R1.1 | v19.68,55.88 22.86,55.88 24.13,57.15 J1.6 25.4,57.47 | JP1.5 JP1.6 34.29,57.15 | 37.78,16.03 38.1,15.24 C4.C 37.78,15.24 38.1,15.4 37.78,16.03 | 37.78,16.03 42.39,16.03
  Bottom 0.305: LCD1.13 31.07,31.07 v32.07,32.07 | 22.82,24.72 22.91,24.72 22.86,24.77 | S.PLUS.1 v17.46,9.53 S.ENTER.3 | S.MINUS.1 34.29,3.17 33.66,2.54 33.66,1.59 | 33.66,1.59 28.57,1.59 24.77,5.4 23.18,5.4 U$4.4 | S.MENU.1 42.86,3.49 40.96,1.59 33.66,1.59
  Bottom 0.406: LCD1.5 24.67,24.23 24.13,24.77 23.81,24.77 | 23.81,24.77 v23.81,29.21 | LCD1.2 22.23,24.13 22.82,24.72 | 23.81,24.77 22.86,24.77
  Bottom 0.508: v29.53,43.18 29.53,36.83 32.07,34.29 v32.07,32.07 | v42.23,18.1 42.23,30.48 v42.86,31.11
  Bottom 0.813: v10.16,22.86 8.57,24.45 v8.57,31.75 v8.57,40.01 v8.57,46.67 8.57,48.58 15.88,55.88 v19.68,55.88
  pour Bottom: 0,0 53.34,0 53.34,59.69 0,59.69
  pour Top: 53.34,0 0,0 0,59.69 53.34,59.69
IOREF
  Top 0.305: SJ3.2 5.58,20.77 4.76,21.59 JP4.1
N$1
  Top 0.305: C9.1 30.04,30.48 Q3.2 28.98,30.8 Q1.1 28.82,32.77 27.32,34.28 U1.8
N$2
  Top 0.305: C10.1 25.2,30.48 Q3.1 25.68,30.96 Q1.3 26.52,31.05 U1.7
N$3  (via drill 0.61)
  Top 0.406: v35.88,27.94 R4.1
  Bottom 0.406: LCD1.3 23.07,20.43 24.45,19.05 34.61,19.05 35.88,20.32 v35.88,27.94
N$4
  Top 0.305: Q2.1 44.5,29.26 45.4,30.16 R8.1
N$5
  Top 0.305: LED2.1 R5.1
N$6
  Top 0.305: SJ4.1 U3.D11
N$8  (via drill 0.61)
  Top 0.305: R3.1 8.73,15.72 v8.26,15.24
  Bottom 0.305: v8.26,15.24 6.67,13.65 6.67,6.67 5.71,5.71 3.17,5.71 2.54,5.08 LED1.C1
N$9
  Top 0.305: SJ5.2 U3.D13
N$12
  Top 0.305: R3.2 8.73,19.84 9.84,20.95 U4.1
N$13
  Top 0.406: U4.5 14.32,23.09 R1.2
N$17
  Top 0.406: Q2.3 40.79,27.16 40.01,27.94 R4.2
RES  (via drill 0.61)
  Top 0.305: U3.RES 5.71,24.13 v6.67,25.4 | 33.07,53.39 C2.1 31.75,53.34 30.64,52.23 23.97,52.23 v23.5,51.75 18.41,51.75 17.14,53.02 RESET.1 | v23.5,42.86 25.08,41.27 25.08,38.73 24.12,37.77 U1.4 24.12,33.96 22.86,32.7 20.95,32.7 17.78,29.53 14.61,29.53 8.26,35.88 v6.67,35.88 6.67,36.83 6.99,37.15 6.99,38.05 R2.1
  Bottom 0.305: v6.67,25.4 v6.67,35.88 | v23.5,42.86 v23.5,51.75 23.5,53.66 24.45,54.61 J1.5
USB.D+  (via drill 0.61)
  Top 0.305: X1.D+ 40.64,12.06 v40.96,12.3 | v46.04,11.43 47.31,10.16 47.31,7.62 48.26,6.67 JP7.1
  Bottom 0.305: v40.96,12.3 45.16,12.3 v46.04,11.43
USB.D-  (via drill 0.61)
  Top 0.305: X1.D- 39.84,12.85 v39.85,13.97 | v43.81,13.97 45.4,13.97 48.58,10.79 48.58,8.57 50.8,6.35 JP7.2
  Bottom 0.305: v39.85,13.97 v43.81,13.97
V+  (via drill 0.61)
  Top 1.016: U5.1 35.01,15.47 34.92,15.24 C4.A
  Top 1.27: U5.1 27.95,14.61 v18.73,14.61
  Top 1.676: JP5.2 v7.94,12.7
  Bottom 1.27: v18.73,14.61 16.83,12.7 v7.94,12.7
VBAT
  Top 0.406: U4.3 11.72,18.92 11.75,18.81 11.59,18.89
  Top 0.813: 11.7,16.41 C8.2 | 11.27,12.06 JP2.2 | C8.2 arc-45 11.75,16.64 arc45 C8.2 | 11.75,16.56 C8.2
  Top 1.016: JP2.2 11.7,16.41 | 8.57,10.16 10.48,12.06 11.27,12.06 | 11.75,18.81 11.75,16.56
  Top 1.676: JP5.1 8.57,10.16
VUSB  (via drill 0.61)
  Top 0.305: LED1.A1 v5.08,7.62
  Top 0.406: X1.VBUS 38.77,8.53 38.66,8.26 | U4.4 14.32,18.76 14.29,18.73 | 16.46,18.1 C7.2 16.51,17.78
  Top 1.016: 14.29,18.73 14.61,18.73 15.24,18.1 16.46,18.1
  Top 1.27: 38.66,8.26 38.66,11.19 37.15,12.7 17.46,12.7 v15.56,14.61 15.56,17.78 16.51,17.78
  Top 1.676: JP5.3 6.35,15.24
  Bottom 0.305: v5.08,7.62 5.08,13.97 3.81,15.24 JP5.3
  Bottom 1.27: 5.08,17.78 8.89,17.78 12.06,14.61 v15.56,14.61 | U3.5V 3.81,29.21 5.08,27.94 5.08,17.78 | 5.08,17.78 JP5.3

### Text on the board
tPlace: A7 | GND | RX | A5 | ICSP | TX | RESET | PROGRAM / 3.3V | A4 | L | RX1 | A3 | TX1 | A2 | D4 | A1 | ~D5 | A0 | ~D6 | D7 | D5 | GND | TouScruino | v1 | D8 | 3.3V | BL | GND | ~D9 | 5V | ~D10 | 3.3V | MOSI | D11 | MISO | RESET | D12 | IOREF | SCK | D13 | D13 | GND | AREF | 5V | SDA | V+ | SCL | BAT | ON | D+ | D- | CHARGE